# Altium schematic sheet Main.SchDoc
size A4; DocumentNumber: 1; SheetNumber: 1
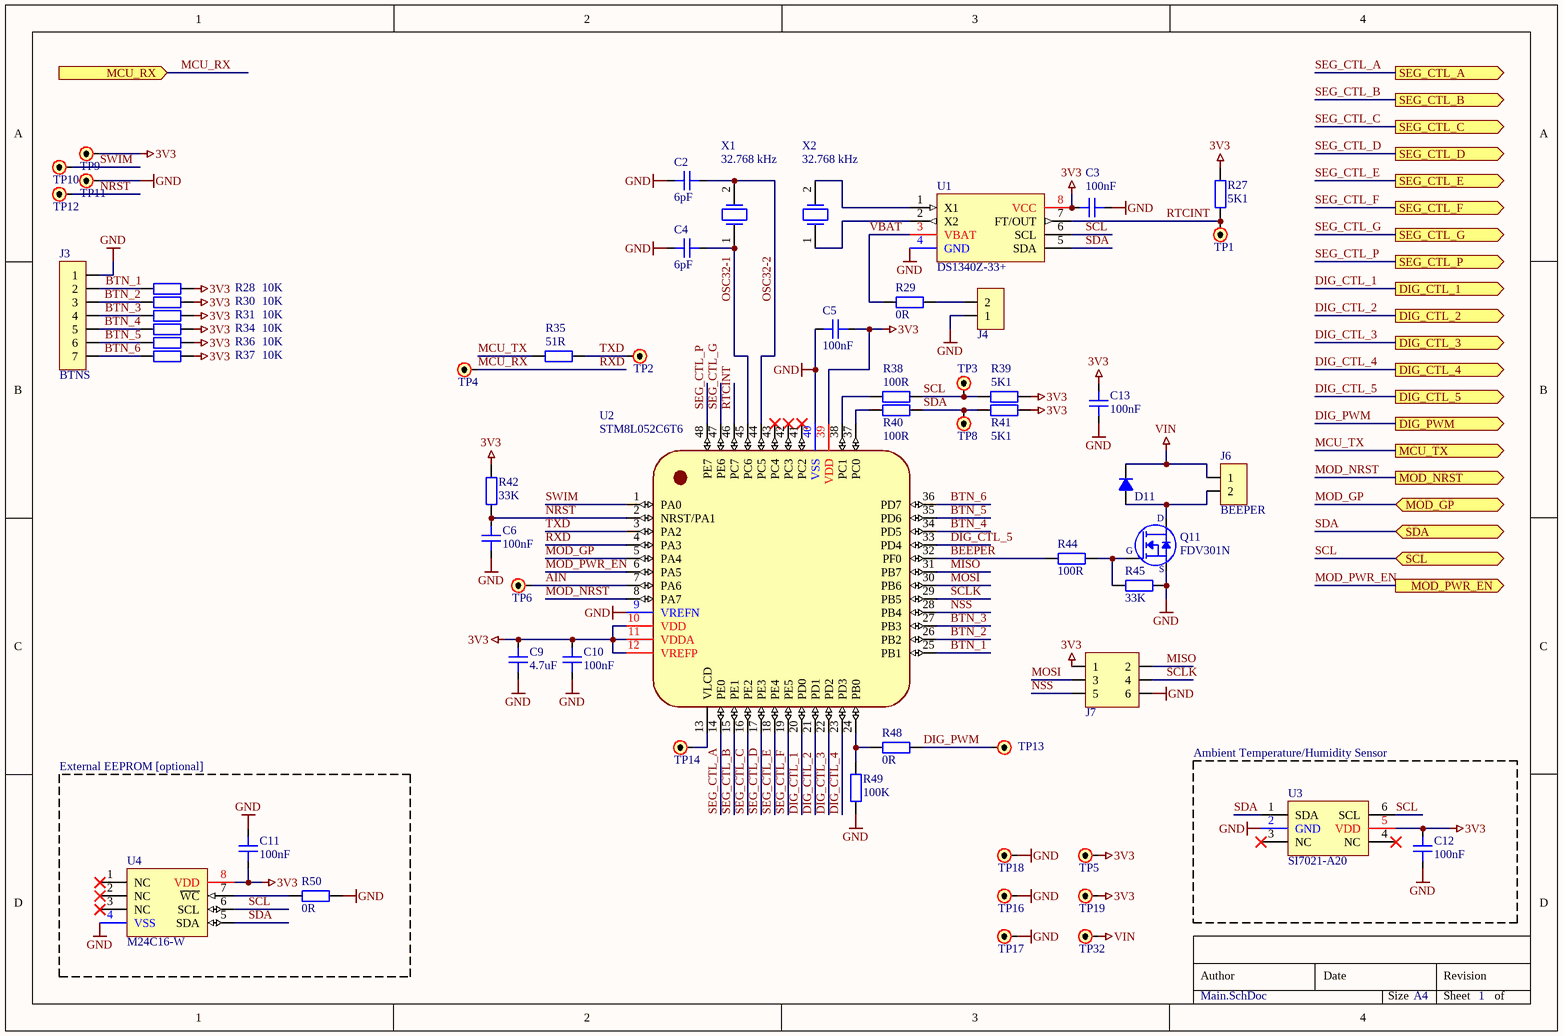
[diagram p0: Main.SchDoc]

## Parts
C2  6pF  [0603C_RF_M]
C3  100nF  [0603C_RF_M]
C4  6pF  [0603C_RF_M]
C5  100nF  [0603C_RF_M]
C6  100nF  [0603C_RF_M]
C9  4.7uF  [0603C_RF_M]
C10  100nF  [0603C_RF_M]
C11  100nF  [0603C_RF_M]
C12  100nF  [0603C_RF_M]
C13  100nF  [0805C_RF_M]
D11  D  [ONSEMI_DO214AC_RF_M]  (value not drawn)
J3  BTNS  [HEADER-2.54-7P1]
J4  PINHDR-2P1  [HEADER-2.54-2P1]  (value not drawn)
J6  BEEPER  [HEADER-2.54-2P1]
J7  PINHDR-6P2-2.54  [HEADER-2.54-6P-2R]  (value not drawn)
Q11  FDV301N  [IRLML_SOT-23]
R27  5K1  [0603R_RF_M]
R28  10K  [0603R_RF_M]
R29  0R  [0805R_RF_M]
R30  10K  [0603R_RF_M]
R31  10K  [0603R_RF_M]
R34  10K  [0603R_RF_M]
R35  51R  [0603R_RF_M]
R36  10K  [0603R_RF_M]
R37  10K  [0603R_RF_M]
R38  100R  [0603R_RF_M]
R39  5K1  [0805R_RF_M]
R40  100R  [0603R_RF_M]
R41  5K1  [0805R_RF_M]
R42  33K  [0603R_RF_M]
R44  100R  [0805R_RF_M]
R45  33K  [0805R_RF_M]
R48  0R  [0603R_RF_M]
R49  100K  [0603R_RF_M]
R50  0R  [0603R_RF_M]
TP1  RTCINT  [PAD_R_1MM]  (value not drawn)
TP2  MCU_TX  [PAD_R_1MM]  (value not drawn)
TP3  SCL  [PAD_R_1MM]  (value not drawn)
TP4  MCU_RX  [PAD_R_1MM]  (value not drawn)
TP5  3V3  [PAD_R_1.5MM]  (value not drawn)
TP6  3V3  [PAD_R_1MM]  (value not drawn)
TP8  SDA  [PAD_R_1MM]  (value not drawn)
TP9  VDD  [PAD_R_1MM]  (value not drawn)
TP10  SWIM  [PAD_R_1MM]  (value not drawn)
TP11  GND  [PAD_R_1MM]  (value not drawn)
TP12  NRST  [PAD_R_1MM]  (value not drawn)
TP13  PWM  [PAD_R_1MM]  (value not drawn)
TP14  VLCD  [PAD_R_1MM]  (value not drawn)
TP16  GND  [PAD_R_1.5MM]  (value not drawn)
TP17  GND  [PAD_R_1.5MM]  (value not drawn)
TP18  GND  [PAD_R_1.5MM]  (value not drawn)
TP19  3V3  [PAD_R_1.5MM]  (value not drawn)
TP32  VIN  [PAD_R_1.5MM]  (value not drawn)
U1  DS1340Z-33+  [SOIC-8]
U2  STM8L052C6T6  [ST_LQFP-48]
U3  SI7021-A20  [SI7021_DFN-6_RF_M]
U4  M24C16-W  [SOIC-8]
X1  32.768 kHz  [XTAL_3215]
X2  32.768 kHz  [XTAL_3215]

## Blocks framed on the sheet
External EEPROM [optional]: C11 R50 U4
Ambient Temperature/Humidity Sensor: C12 U3

## Ports
DIG_CTL_1 (out), DIG_CTL_2 (out), DIG_CTL_3 (out), DIG_CTL_4 (out), DIG_CTL_5 (out), DIG_PWM (out), MCU_RX (in), MCU_TX (out), MOD_GP (bidir), MOD_NRST (out), MOD_PWR_EN (out), SCL (bidir), SDA (bidir), SEG_CTL_A (out), SEG_CTL_B (out), SEG_CTL_C (out), SEG_CTL_D (out), SEG_CTL_E (out), SEG_CTL_F (out), SEG_CTL_G (out), SEG_CTL_P (out)

## Nets
3V3: C3.2 C5.1 C9.2 C10.2 C11.2 C12.2 C13.2 J7.1 R27.2 R28.2 R30.2 R31.2 R34.2 R36.2 R37.2 R39.2 R41.2 R42.2 TP5.1 TP9.1 TP19.1 U1.8(VCC) U2.10(VDD) U2.11(VDDA) U2.12(VREFP) U2.39(VDD) U3.5(VDD) U4.8(VDD)
GND: C2.2 C3.1 C4.2 C5.2 C6.1 C9.1 C10.1 C11.1 C12.1 C13.1 J3.1 J4.1 J7.6 Q11.2(S) R45.1 R49.2 R50.2 TP11.1 TP16.1 TP17.1 TP18.1 U1.4(GND) U2.9(VREFN) U2.40(VSS) U3.2(GND) U4.4(VSS)
VIN: D11.C J6.1 TP32.1
AIN: TP6.1 U2.7(PA6)
BEEPER: R44.1 U2.32(PF0)
BTN_1: J3.2 R28.1 U2.25(PB1)
BTN_2: J3.3 R30.1 U2.26(PB2)
BTN_3: J3.4 R31.1 U2.27(PB3)
BTN_4: J3.5 R34.1 U2.34(PD5)
BTN_5: J3.6 R36.1 U2.35(PD6)
BTN_6: J3.7 R37.1 U2.36(PD7)
DIG_CTL_1: U2.20(PD0) ; port DIG_CTL_1
DIG_CTL_2: U2.21(PD1) ; port DIG_CTL_2
DIG_CTL_3: U2.22(PD2) ; port DIG_CTL_3
DIG_CTL_4: U2.23(PD3) ; port DIG_CTL_4
DIG_CTL_5: U2.33(PD4) ; port DIG_CTL_5
DIG_PWM: R48.1 TP13.1 ; port DIG_PWM
MCU_RX: TP4.1 U2.4(PA3) ; port MCU_RX  [also labelled RXD]
MCU_TX: R35.1 ; port MCU_TX
MISO: J7.2 U2.31(PB7)
MOD_GP: U2.5(PA4) ; port MOD_GP
MOD_NRST: U2.8(PA7) ; port MOD_NRST
MOD_PWR_EN: U2.6(PA5) ; port MOD_PWR_EN
MOSI: J7.3 U2.30(PB6)
NRST: C6.2 R42.1 TP12.1 U2.2(NRST/PA1)
NSS: J7.5 U2.28(PB4)
OSC32-1: C4.1 U2.45(PC6) X1.1
OSC32-2: C2.1 U2.44(PC5) X1.2
RTCINT: R27.1 TP1.1 U1.7(FT/OUT) U2.46(PC7)
SCL: R38.2 R39.1 TP3.1 U1.6(SCL) U3.6(SCL) U4.6(SCL) ; port SCL
SCLK: J7.4 U2.29(PB5)
SDA: R40.2 R41.1 TP8.1 U1.5(SDA) U3.1(SDA) U4.5(SDA) ; port SDA
SEG_CTL_A: U2.14(PE0) ; port SEG_CTL_A
SEG_CTL_B: U2.15(PE1) ; port SEG_CTL_B
SEG_CTL_C: U2.16(PE2) ; port SEG_CTL_C
SEG_CTL_D: U2.17(PE3) ; port SEG_CTL_D
SEG_CTL_E: U2.18(PE4) ; port SEG_CTL_E
SEG_CTL_F: U2.19(PE5) ; port SEG_CTL_F
SEG_CTL_G: U2.47(PE6) ; port SEG_CTL_G
SEG_CTL_P: U2.48(PE7) ; port SEG_CTL_P
SWIM: TP10.1 U2.1(PA0)
TXD: R35.2 TP2.1 U2.3(PA2)
VBAT: R29.2 U1.3(VBAT)
NetD11_A: D11.A J6.2 Q11.3(D)
NetJ4_2: J4.2 R29.1
NetQ11_1: Q11.1(G) R44.2 R45.2
NetR38_1: R38.1 U2.38(PC1)
NetR40_1: R40.1 U2.37(PC0)
NetR48_2: R48.2 R49.1 U2.24(PB0)
NetR50_1: R50.1 U4.7(~{WC})
NetTP14_1: TP14.1 U2.13(VLCD)
NetU1_1: U1.1(X1) X2.2
NetU1_2: U1.2(X2) X2.1

Not connected (* = marked no-connect by the designer): U2 41(PC2)* 42(PC3)* 43(PC4)*; U3 3(NC)* 4(NC)*; U4 1(NC)* 2(NC)* 3(NC)*

## Notes on the sheet
- Author
- Date
- Revision
- Size
- A4
- Sheet
- of

## Library data of the parts
C2-C6 C9-C13 = C: Capacitor; Manufacturer: Generic Brand; Max Voltage: ? V; Tolerance: ?; Mounting Technology: SMT; Tag: *; Manufacturer Part No: *; Supplier: *; Supplier Link: http://; Supplier Part No: *; Category: Capacitor
  C2 C4: Value: 6pF
  C3 C5 C6 C10-C13: Value: 100nF
  C9: Value: 4.7uF
D11 = D: Diode (Rectifier); Manufacturer: Generic Brand; Max Forward Voltage: ? V; Power Rating: ? W; Manufacturer Part No: *; Supplier: *; Supplier Link: http://; Supplier Part No: *; Mounting Technology: SMT; Category: Diode
J3 = PINHDR-7P1: Pin Header Single Row 7 Positions; Mounting Technology: THT
J4 J6 = PINHDR-2P1: Pin Header Single Row 2 Positions; Mounting Technology: THT
J7 = PINHDR-6P2-2.54: Rectangular Pin Header 6 Positions 2 Rows
Q11 = FDV301N: MOSFET N-CH 25V 220MA SOT23; Manufacturer: ON Semiconductor; Manufacturer Part No: FDV301N; Supplier: DigiKey; Supplier Link: https://www.digikey.com/en/products/detail/on-semiconductor/FDV301N/458851; Supplier Part No: FDV301NCT-ND; Mounting Technology: SMT; Package: SOT-23; Alternative Supplier: Chipdip; Alternative Supplier Part No: 9010000157; Alternative Supplier Link: https://www.chipdip.by/product/fdv301n-2
R27-R31 R34-R42 R44 R45 R48-R50 = R: Resistor; Manufacturer: Generic Brand; Power Rating: ? W; Max Voltage: ? V; Tolerance: ?; Supplier Link: http://; Category: Resistor; Mounting Technology: SMT
  R27 R39 R41: Value: 5K1
  R28 R30 R31 R34 R36 R37: Value: 10K
  R29 R48 R50: Value: 0R
  R35: Value: 51R
  R38 R40 R44: Value: 100R
  R42 R45: Value: 33K
  R49: Value: 100K
TP1-TP6 TP8-TP14 TP16-TP19 TP32 = Test Point: Test Point / Pad
U1 = DS1340Z-33+: IC RTC CLK/CALENDAR I2C 8-SOIC; Manufacturer: Maxim Integrated; VCC: 3.3V; Manufacturer Part No: DS1340Z-33+; Alternative Supplier: Chipdip; Alternative Supplier Link: https://www.chipdip.by/product/ds1340z-33-2; Alternative Supplier Part No: 9000387657; Supplier Part No: DS1340Z-33+-ND; Supplier: DigiKey; Supplier Link: https://www.digikey.com/en/products/detail/maxim-integrated/DS1340Z-33/680583; Mounting Technology: SMT; Package: SOIC-8; Category: IC/RTC
U2 = STM8L052C6T6: IC MCU 8BIT 32KB FLASH 48LQFP; Manufacturer: STMicroelectronics; Supplier: DigiKey; Supplier Link: https://www.digikey.com/en/products/detail/stmicroelectronics/STM8L052C6T6/3317784; Supplier Part No: 497-13041-ND; Manufacturer Product Number: STM8L052C6T6; Package: LQFP-48; Mounting Technology: SMT
U3 = SI7021-A20: SENS HUMID/TEMP 3.6V I2C 2% 6DFN; Manufacturer Product Number: SI7021-A20-GM1R; Manufacturer: Silicon Labs; Supplier URL: https://www.digikey.com/en/products/detail/silicon-labs/SI7021-A20-GM1/5048934; Supplier Part No: 336-4380-1-ND; Supplier Package: Cut Tape (CT); Mounting Type: SMT; Package: DFN-6
U4 = M24C16-W: IC SRL EEPROM 16KBIT 2.5V 8-SOIC; Manufacturer: STMicroelectronics; Manufacturer Product Number: M24C16-WMN6TP; Base Product Number: M24C16; Supplier: DigiKey; Supplier URL: https://www.digikey.com/en/products/detail/stmicroelectronics/M24C16-WMN6TP/1007246; Supplier Part No: 497-17785-1-ND; Supplier Package: Cut Tape; Mounting Type: SMT; Operating Temperature: -40°C ~ 85°C (TA); Supplier Price: $0.14
X1 X2 = KX-327NHT: Crystal Resonator (2 Leads); Manufacturer: Geyer; Load Capacitance: 12.5 pF; Tolerance: 20 ppm; Manufacturer Part No: KX-327NHT; Mounting Technology: SMT; Alternative Supplier: Belchip; Alternative Supplier Link: https://belchip.by/product/?selected_product=33387; Alternative Supplier Part No: 33387; Category: Crystal; Value: 32.768 kHz